# Altium project 嵌赛开发板_STM32G474CBT6.PrjPcb
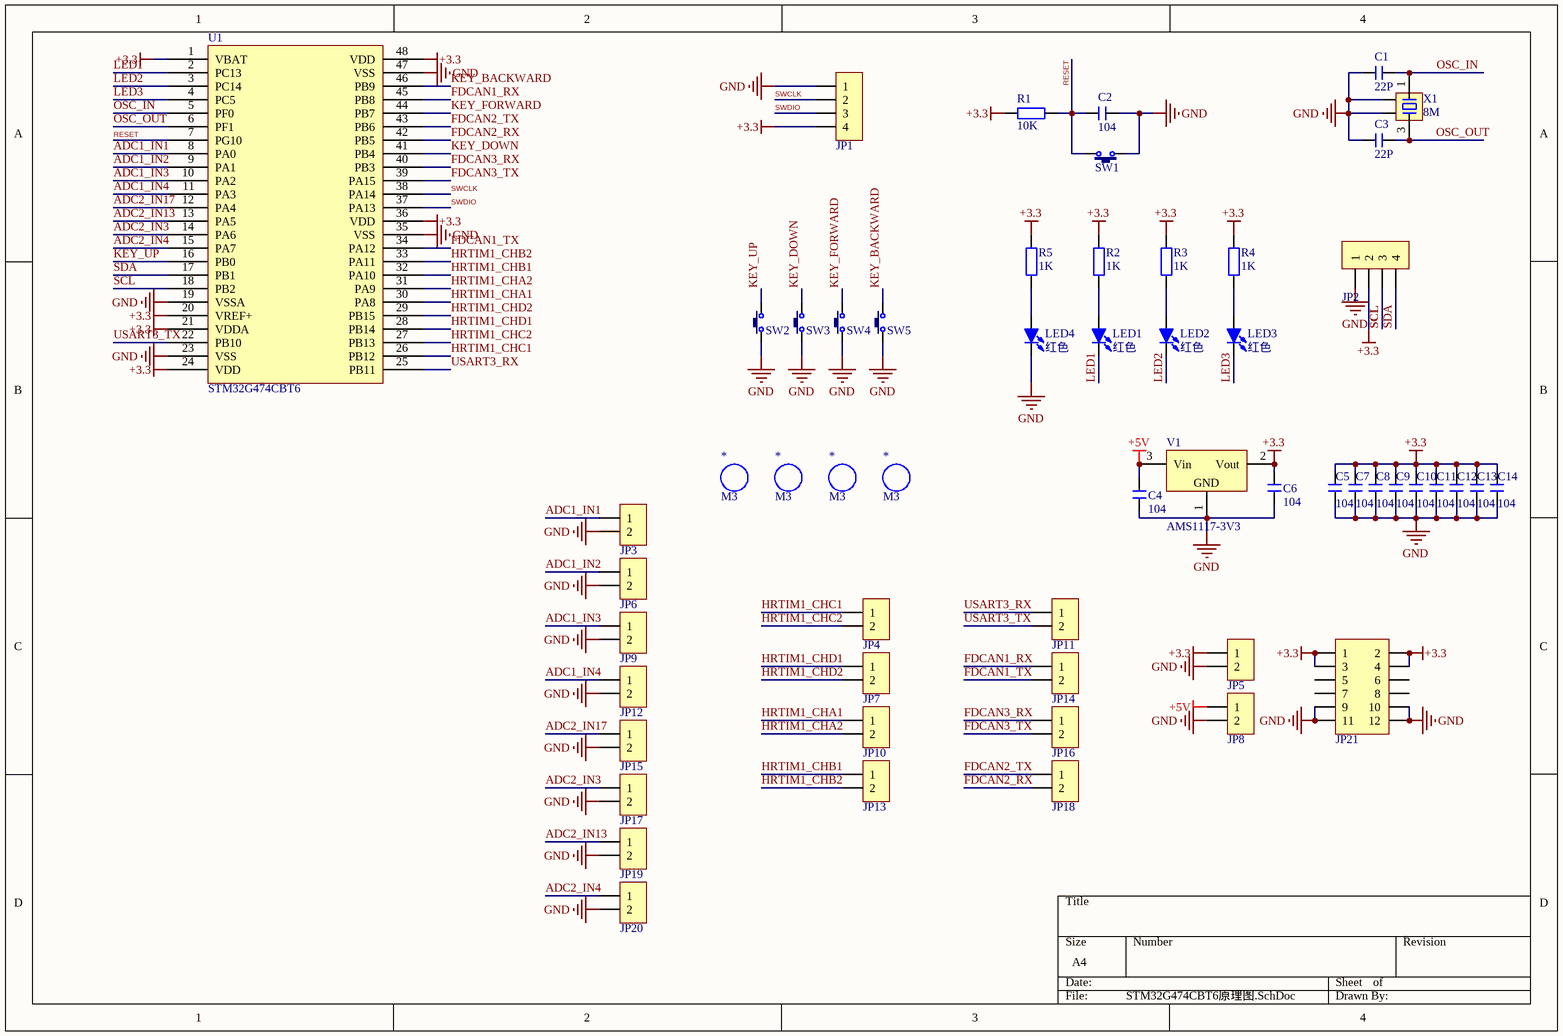
[diagram p0: STM32G474CBT6原理图.SchDoc]
1 sheet, 56 parts. Net scope: global (net labels, ports and power ports of the same name join across sheets).
Board file: STM32G474CBT6_PCB.PcbDoc

## Sheet STM32G474CBT6原理图.SchDoc
size A4; SheetNumber: 1; SheetTotal: 1

### Parts
(Parts that share a designator on the sheet are numbered #1, #2 ... from top to bottom, then left to right.)
*#1  M3  [M3 125X200]
*#2  M3  [M3 125X200]
*#3  M3  [M3 125X200]
*#4  M3  [M3 125X200]
C1  22P  [C 0603]
C2  104  [C 0603]
C3  22P  [C 0603]
C4  104  [C 0603]
C5  104  [C 0402]
C6  104  [C 0603]
C7  104  [C 0402]
C8  104  [C 0402]
C9  104  [C 0402]
C10  104  [C 0402]
C11  104  [C 0402]
C12  104  [C 0402]
C13  104  [C 0402]
C14  104  [C 0402]
JP1  HDR-1X4  [XH2.54-4P]  (value not drawn)
JP2  HDR-1X4  [HDR-1X4]  (value not drawn)
JP3  HDR-1X2  [XH2.54-2P]  (value not drawn)
JP4  HDR-1X2  [XH2.54-2P]  (value not drawn)
JP5  HDR-1X2  [XH2.54-2P]  (value not drawn)
JP6  HDR-1X2  [XH2.54-2P]  (value not drawn)
JP7  HDR-1X2  [XH2.54-2P]  (value not drawn)
JP8  HDR-1X2  [XH2.54-2P]  (value not drawn)
JP9  HDR-1X2  [XH2.54-2P]  (value not drawn)
JP10  HDR-1X2  [XH2.54-2P]  (value not drawn)
JP11  HDR-1X2  [XH2.54-2P]  (value not drawn)
JP12  HDR-1X2  [XH2.54-2P]  (value not drawn)
JP13  HDR-1X2  [XH2.54-2P]  (value not drawn)
JP14  HDR-1X2  [XH2.54-2P]  (value not drawn)
JP15  HDR-1X2  [XH2.54-2P]  (value not drawn)
JP16  HDR-1X2  [XH2.54-2P]  (value not drawn)
JP17  HDR-1X2  [XH2.54-2P]  (value not drawn)
JP18  HDR-1X2  [XH2.54-2P]  (value not drawn)
JP19  HDR-1X2  [XH2.54-2P]  (value not drawn)
JP20  HDR-1X2  [XH2.54-2P]  (value not drawn)
JP21  Header 6X2  [HDR-6X2]  (value not drawn)
LED1  红色  [LED 0603B]
LED2  红色  [LED 0603B]
LED3  红色  [LED 0603B]
LED4  红色  [LED 0603B]
R1  10K  [R 0603]
R2  1K  [R 0603]
R3  1K  [R 0603]
R4  1K  [R 0603]
R5  1K  [R 0603]
SW1  3x6x5  [无声微动开关]  (value not drawn)
SW2  3x6x5  [无声微动开关]  (value not drawn)
SW3  3x6x5  [无声微动开关]  (value not drawn)
SW4  3x6x5  [无声微动开关]  (value not drawn)
SW5  3x6x5  [无声微动开关]  (value not drawn)
U1  STM32G474CBT6  [LQFP48 7X7_L]
V1  AMS1117-3V3  [SOT89_M]
X1  8M  [XTAL-3225]

### Nets
+3.3: C5.2 C6.2 C7.2 C8.2 C9.2 C10.2 C11.2 C12.2 C13.2 C14.2 JP1.4 JP2.2 JP5.1 JP21.1 JP21.2 JP21.3 JP21.4 R1.2 R2.2 R3.2 R4.2 R5.2 U1.1(VBAT) U1.20(VREF+) U1.21(VDDA) U1.24(VDD) U1.36(VDD) U1.48(VDD) V1.2(Vout)
+5V: C4.2 JP8.1 V1.3(Vin)
GND: C1.1 C2.2 C3.1 C4.1 C5.1 C6.1 C7.1 C8.1 C9.1 C10.1 C11.1 C12.1 C13.1 C14.1 JP1.1 JP2.1 JP3.2 JP5.2 JP6.2 JP8.2 JP9.2 JP12.2 JP15.2 JP17.2 JP19.2 JP20.2 JP21.9 JP21.10 JP21.11 JP21.12 LED4.2(K) SW1.1 SW2.1 SW3.1 SW4.1 SW5.1 U1.19(VSSA) U1.23(VSS) U1.35(VSS) U1.47(VSS) V1.1(GND) X1.2 X1.4
ADC1_IN1: JP3.1 U1.8(PA0)
ADC1_IN2: JP6.1 U1.9(PA1)
ADC1_IN3: JP9.1 U1.10(PA2)
ADC1_IN4: JP12.1 U1.11(PA3)
ADC2_IN3: JP17.1 U1.14(PA6)
ADC2_IN4: JP20.1 U1.15(PA7)
ADC2_IN13: JP19.1 U1.13(PA5)
ADC2_IN17: JP15.1 U1.12(PA4)
FDCAN1_RX: JP14.1 U1.45(PB8)
FDCAN1_TX: JP14.2 U1.34(PA12)
FDCAN2_RX: JP18.2 U1.42(PB5)
FDCAN2_TX: JP18.1 U1.43(PB6)
FDCAN3_RX: JP16.1 U1.40(PB3)
FDCAN3_TX: JP16.2 U1.39(PA15)
HRTIM1_CHA1: JP10.1 U1.30(PA8)
HRTIM1_CHA2: JP10.2 U1.31(PA9)
HRTIM1_CHB1: JP13.1 U1.32(PA10)
HRTIM1_CHB2: JP13.2 U1.33(PA11)
HRTIM1_CHC1: JP4.1 U1.26(PB12)
HRTIM1_CHC2: JP4.2 U1.27(PB13)
HRTIM1_CHD1: JP7.1 U1.28(PB14)
HRTIM1_CHD2: JP7.2 U1.29(PB15)
KEY_BACKWARD: SW5.2 U1.46(PB9)
KEY_DOWN: SW3.2 U1.41(PB4)
KEY_FORWARD: SW4.2 U1.44(PB7)
KEY_UP: SW2.2 U1.16(PB0)
LED1: LED1.2(K) U1.2(PC13)
LED2: LED2.2(K) U1.3(PC14)
LED3: LED3.2(K) U1.4(PC5)
OSC_IN: C1.2 U1.5(PF0) X1.1
OSC_OUT: C3.2 U1.6(PF1) X1.3
RESET: C2.1 R1.1 SW1.2 U1.7(PG10)
SCL: JP2.3 U1.18(PB2)
SDA: JP2.4 U1.17(PB1)
SWCLK: JP1.2 U1.38(PA14)
SWDIO: JP1.3 U1.37(PA13)
USART3_RX: JP11.1 U1.25(PB11)
USART3_TX: JP11.2 U1.22(PB10)
NetLED1_1: LED1.1(A) R2.1
NetLED2_1: LED2.1(A) R3.1
NetLED3_1: LED3.1(A) R4.1
NetLED4_1: LED4.1(A) R5.1

Not connected (* = marked no-connect by the designer): JP21 5 6 7 8

### Library data of the parts
*#1-*#4 = M3: 铜柱孔; 版权归属: 源创客; BOM名称: 铜柱孔; 学习资源: www.ooocke.com
C1 C3-C14 = C: 无极性贴片电容; 版权归属: 源创客; BOM名称: 无极性贴片电容; 学习资源: www.ooocke.com
C2 = C-CC: 直插瓷片电容; 版权归属: 源创客; BOM名称: 直插瓷片电容; 学习资源: www.ooocke.com
JP1 JP2 = Header 4: 4P接插件; 版权归属: 源创客; BOM名称: 4P接插件; 学习资源: www.ooocke.com
JP3-JP20 = Header 2: 2P接插件; 版权归属: 源创客; BOM名称: 2P接插件; 学习资源: www.ooocke.com
JP21 = Header  6X2: 6*2P接插件; 版权归属: 源创客; BOM名称: 6*2P接插件; 学习资源: www.ooocke.com
LED1-LED4 = LED-SMD: 贴片LED; 版权归属: 源创客; BOM名称: 贴片LED; 学习资源: www.ooocke.com
R1 = R-CRR: 直插色环电阻; BOM名称: 色环电阻; 版权归属: 源创客; 学习资源: www.ooocke.com
R2-R5 = R: 贴片电阻; 版权归属: 源创客; BOM名称: 贴片电阻; 学习资源: www.ooocke.com
SW1-SW5 = TSW 3x6: 3x6轻触开关; 版权归属: 源创客; BOM名称: 3x6轻触开关; 学习资源: www.ooocke.com
V1 = AMS1117: 三端稳压芯片; BOM名称: 稳压芯片; 版权归属: 源创客; 学习资源: www.ooocke.com
X1 = XTAL-4: 4脚晶振; 版权归属: 源创客; BOM名称: 4脚晶振; 学习资源: www.ooocke.com